# EAGLE design magnet-motor-encoder_v1 (EAGLE 6.6.0)
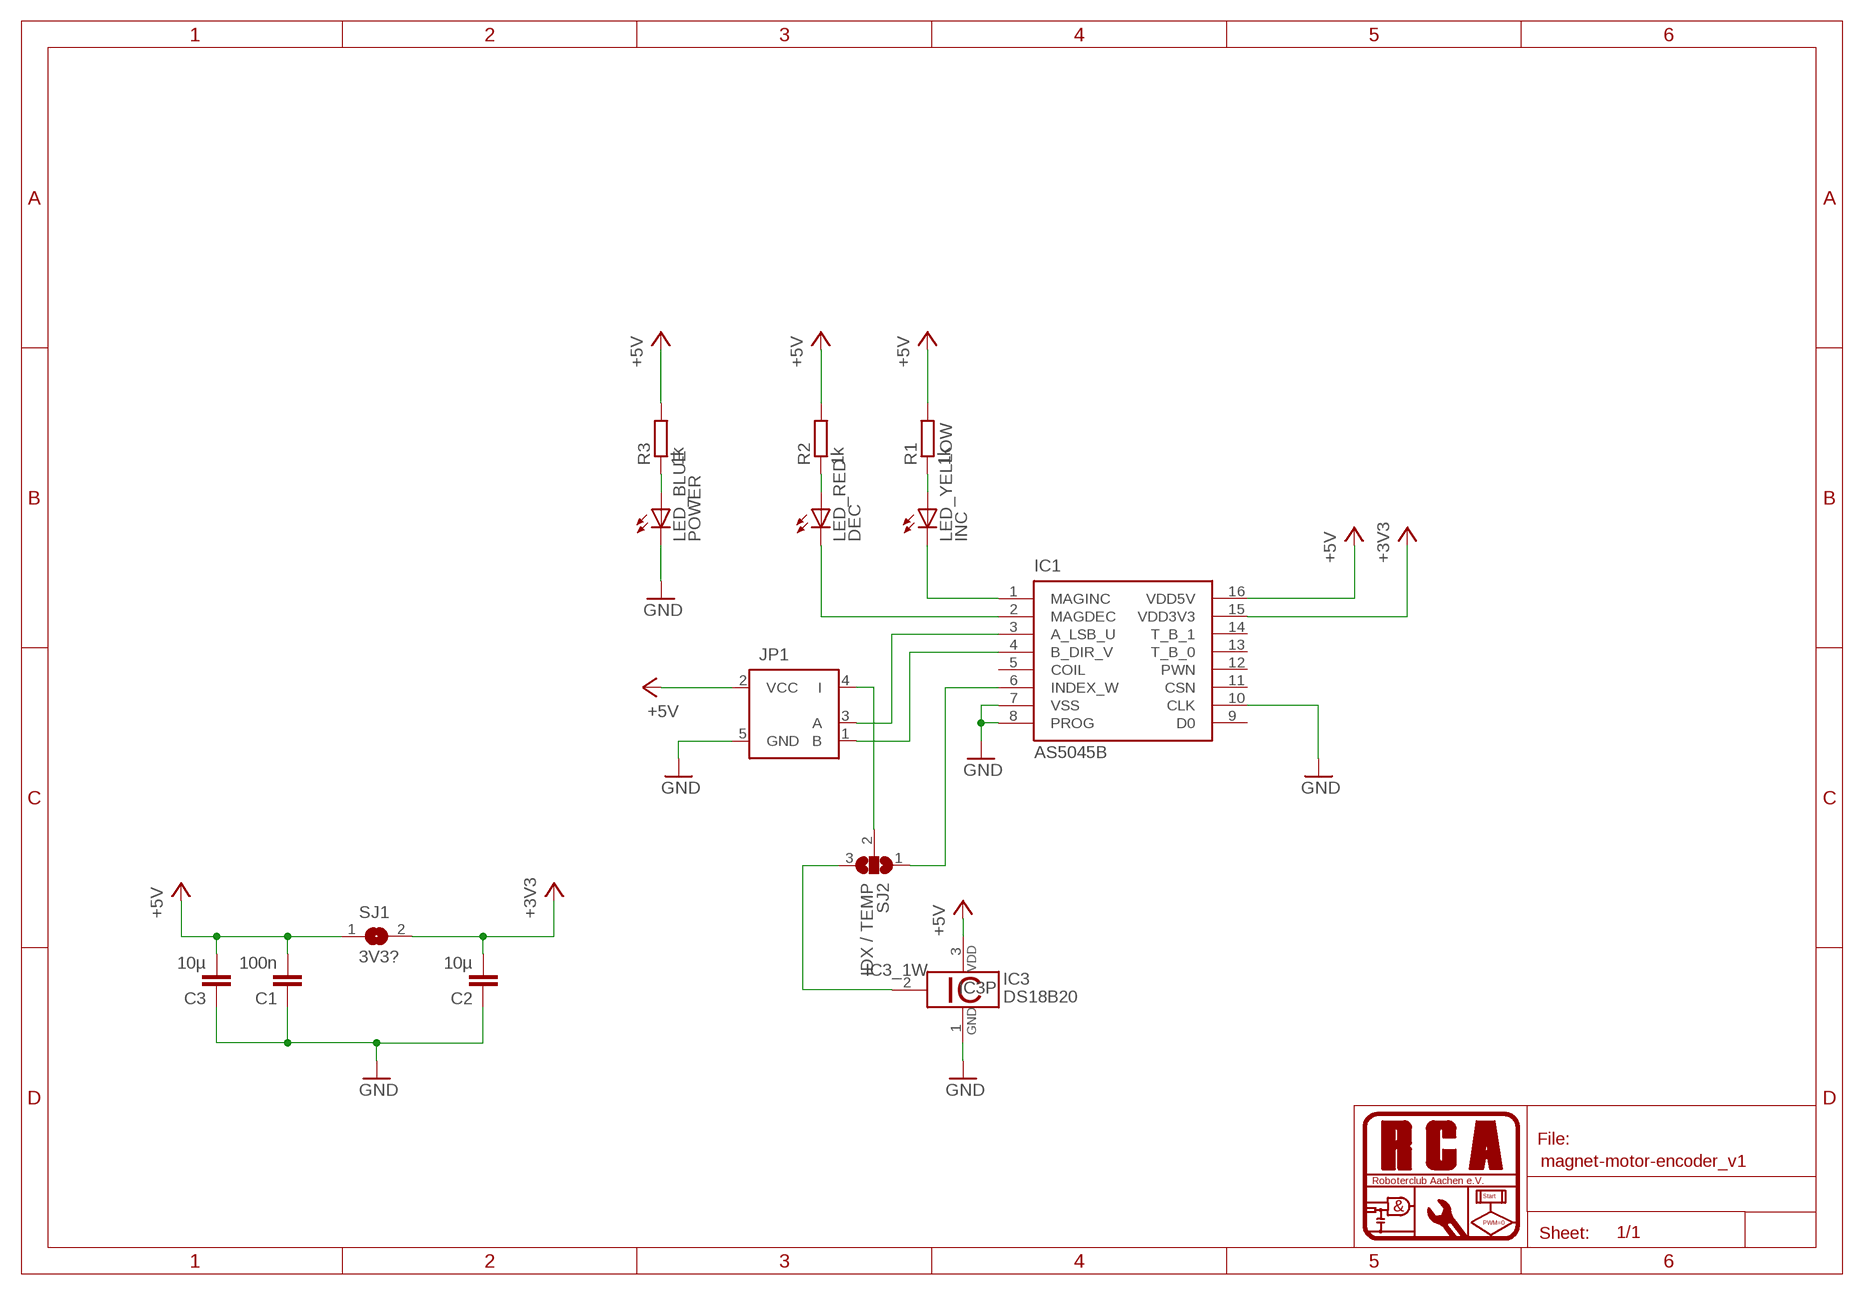
[diagram p0: schematic, sheet 1]

## Parts
C1  100n  C-EUC0805K  [C0805K]
C2  10µ  C-EUC0805K  [C0805K]
C3  10µ  C-EUC0805K  [C0805K]
IC1  AS5045B  AS5040  [SSOP16]
IC3  DS18B20  DS18S20  [TO92-]
JP1  ENCODERPSS  [22-23-2051]
LED_BLUE  POWER  LEDCHIPLED_0805  [CHIPLED_0805]
LED_RED  DEC  LEDCHIPLED_0805  [CHIPLED_0805]
LED_YELLOW  INC  LEDCHIPLED_0805  [CHIPLED_0805]
R1  1k  R-EU_R0805  [R0805]
R2  1k  R-EU_R0805  [R0805]
R3  1k  R-EU_R0805  [R0805]
SJ1  3V3?  SJS  [SJS]
SJ2  IDX / TEMP  SJ2W  [SJ_2]

## Nets
+3V3: C2.2 IC1.15(VDD3V3) SJ1.2
+5V: C1.2 C3.2 IC1.16(VDD5V) IC3.3 JP1.2(VCC) R1.2 R2.2 R3.2 SJ1.1
A: IC1.3(A_LSB_U) JP1.3(A)
B: IC1.4(B_DIR_V) JP1.1(B)
GND: C1.1 C2.1 C3.1 IC1.7(VSS) IC1.8(PROG) IC1.10(CLK) IC3.1 JP1.5(GND) LED_BLUE.C
LED_RED: IC1.2(MAGDEC) LED_RED.C
LED_YELLOW: IC1.1(MAGINC) LED_YELLOW.C
N$1: JP1.4(I) SJ2.2
N$2: IC1.6(INDEX_W) SJ2.1
N$3: IC3.2 SJ2.3
R_LED_BLUE: LED_BLUE.A R3.1
R_LED_RED: LED_RED.A R2.1
R_LED_YELLOW: LED_YELLOW.A R1.1
Unconnected: IC1.5(COIL) IC1.9(D0) IC1.11(CSN) IC1.12(PWN) IC1.13(T_B_0) IC1.14(T_B_1)

## Library data of the parts
C1-C3 = resistor:C-EU: CAPACITOR, European symbol
IC1 = austriamicrosystems:AS5040: 10-BIT PROGRAMMABLE MAGNETIC ROTARY ENCODER Source: www.austriamicrosystems.com .. AS5040DataSheetRev12.pdf; MPN: AS5040ASSU; OC_FARNELL: 1630800; OC_NEWARK: 59P4059
IC3 = 1wire:DS18S20: High Precision Digital Thermometer This chip provides a onewire thermosensor with approx. 0.5°C accuracy.A programmable over/undertemperure alarm is available. Notes: Vdd must be applied for accurate measurements at low temperatures, as the parasite power circuit otherwise heats the sensor. If parasite power is used, Vdd has to be connected to GND. The DS1822 is a low-cost thermometer chip, the DS18B20 is similar to the DS18S20, but with 9..12 Bit programmable precision. Author: Jan Kandziora <jjj@gmx.de>
JP1 = rca_stecker:ENCODER: Encoder Stecker ab 2013: passt direkt auf die Dunkermotoren. vor 2013: Pinout umgedreht
LED_BLUE LED_RED LED_YELLOW = led:LED: LED OSRAM: - CHIPLED LG R971, LG N971, LY N971, LG Q971, LY Q971, LO R971, LY R971 LH N974, LH R974 LS Q976, LO Q976, LY Q976 LO Q996 - Hyper CHIPLED LW Q18S LB Q993, LB Q99A, LB R99A - SideLED LS A670, LO A670, LY A670, LG A670, LP A670 LB A673, LV A673, LT A673, LW A673 LH A674 LY A675 LS A676, LA A676, LO A676, LY A676, LW A676 LS A679, LY A679, LG A679 - Hyper Micro SIDELED® LS Y876, LA Y876, LO Y876, LY Y876 LT Y87S - SmartLED LW L88C, LW L88S LB L89C, LB L89S, LG L890 LS L89K, LO L89K, LY L89K LS L896, LA L896, LO L896, LY L896 - TOPLED LS T670, LO T670, LY T670, LG T670, LP T670 LSG T670, LSP T670, LSY T670, LOP T670, LYG T670 LG T671, LOG T671, LSG T671 LB T673, LV T673, LT T673, LW T673 LH T674 LS T676, LA T676, LO T676, LY T676, LB T676, LH T676, LSB T676, LW T676 LB T67C, LV T67C, LT T67C, LS T67K, LO T67K, LY T67K, LW E67C LS E67B, LA E67B, LO E67B, LY E67B, LB E67C, LV E67C, LT E67C LW T67C LS T679, LY T679, LG T679 LS T770, LO T770, LY T770, LG T770, LP T770 LB T773, LV T773, LT T773, LW T773 LH T774 LS E675, LA E675, LY E675, LS T675 LS T776, LA T776, LO T776, LY T776, LB T776 LHGB T686 LT T68C, LB T68C - Hyper Mini TOPLED® LB M676 - Mini TOPLED Santana® LG M470 LS M47K, LO M47K, LY M47K Source: http://www.osram.convergy.de LUXEON: - LUMILED® LXK2-PW12-R00, LXK2-PW12-S00, LXK2-PW14-U00, LXK2-PW14-V00 LXK2-PM12-R00, LXK2-PM12-S00, LXK2-PM14-U00 LXK2-PE12-Q00, LXK2-PE12-R00, LXK2-PE12-S00, LXK2-PE14-T00, LXK2-PE14-U00 LXK2-PB12-K00, LXK2-PB12-L00, LXK2-PB12-M00, LXK2-PB14-N00, LXK2-PB14-P00, LXK2-PB14-Q00 LXK2-PR12-L00, LXK2-PR12-M00, LXK2-PR14-Q00, LXK2-PR14-R00 LXK2-PD12-Q00, LXK2-PD12-R00, LXK2-PD12-S00 LXK2-PH12-R00, LXK2-PH12-S00 LXK2-PL12-P00, LXK2-PL12-Q00, LXK2-PL12-R00 Source: www.luxeon.com KINGBRIGHT: KA-3528ASYC Source: www.kingbright.com
R1-R3 = resistor:R-EU_: RESISTOR, European symbol
SJ1 = rca_sontiges:SJ: SMD solder JUMPER
SJ2 = jumper:SJ2W: SMD solder JUMPER

## Board
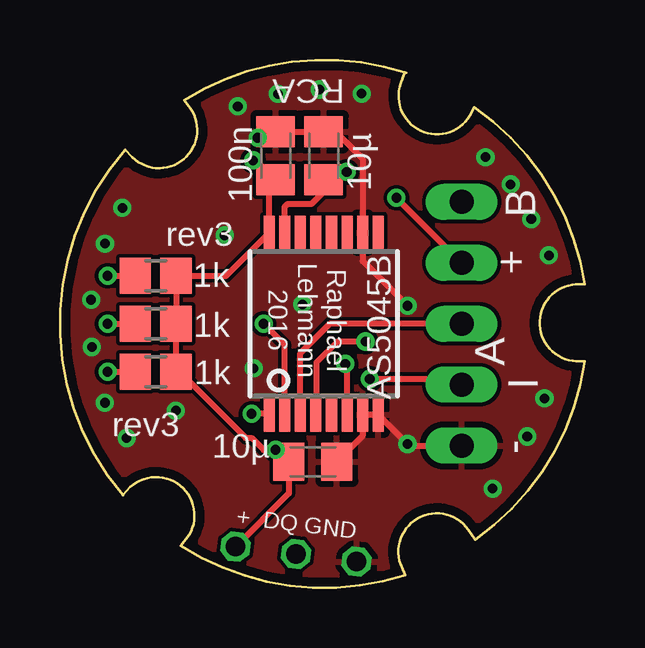
[diagram p1: board, top side]
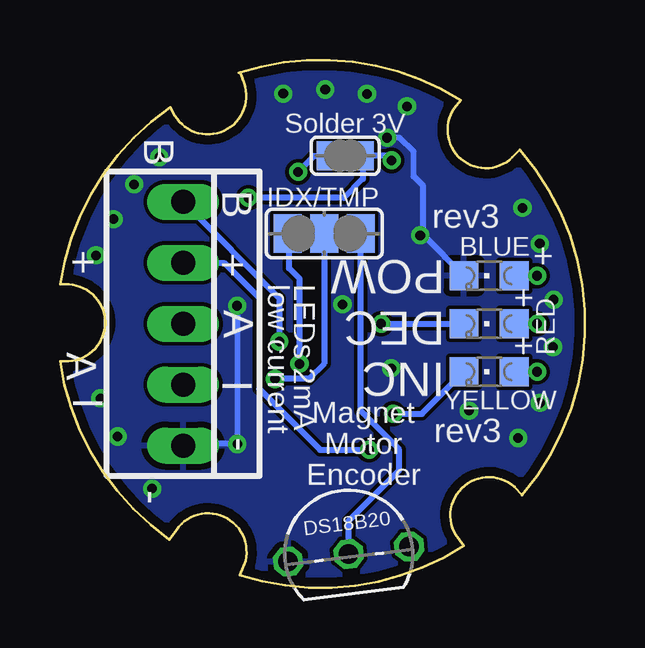
[diagram p2: board, bottom side, seen from below]

Size 21.87 x 21.98 mm. Coordinates in mm from the lower left corner, seen from the top.
Outline: 14.42,21.44 arc50 5.17,20.31 5.44,19.97 arc-169 3.02,17.92 2.72,18.24 arc82 2.63,3.84
Outline: 17.31,2 arc47 21.87,9.42 21.52,9.43 arc-174 21.5,12.63 21.87,12.63 arc47 17.27,20.01 17.08,19.66 arc-168 14.2,21.01
Outline: 2.62,3.85 2.94,4.2
Outline: 2.93,4.19 arc-162 5.39,2.19 5.04,1.74 arc51 14.38,0.52 14.14,1.12 arc-158 17.01,2.41 17.31,1.99
Outline: 14.2,21.02 14.36,21.46
Copper layers (1*16): Top 0.0356mm / dielectric 1.5011mm / Bottom 0.0356mm
Design rules "LaenPCBOrder *": minimum track width 6mil, minimum drill 13mil, track to track 6mil, track to pad 6mil, pad to pad 6mil, via to via 6mil, smd to smd 6mil, copper to edge 15mil, drill to drill 6mil, minimum pad ring 7mil, minimum via ring 7mil, stop-mask expansion 3mil, vias tented up to drill 20mil, thermal gap 10mil

### Footprints (pad centres in the part's own frame; a part is rotated, then mirrored left to right if it is on the bottom)
C0805K = smd 1.3 x 1.6: 1 -1,0; 2 1,0
SSOP16 = smd 0.46 x 1.43: 1 -2.275,-3.795; 2 -1.625,-3.795; 3 -0.975,-3.795; 4 -0.325,-3.795; 5 0.325,-3.795; 6 0.975,-3.795; 7 1.625,-3.795; 8 2.275,-3.795; 9 2.275,3.795; 10 1.625,3.795; 11 0.975,3.795; 12 0.325,3.795; 13 -0.325,3.795; 14 -0.975,3.795; 15 -1.625,3.795; 16 -2.275,3.795
TO92- = drill 0.813 octagon: 1 -2.54,0; 2 0,0; 3 2.54,0
22-23-2051 = drill 1 long: 1 -5.08,0; 2 -2.54,0; 3 0,0; 4 2.54,0; 5 5.08,0
CHIPLED_0805 = smd 1.2 x 1.2: A 0,-1.05; C 0,1.05
R0805 = smd 1.3 x 1.5: 1 -0.85,0; 2 0.85,0
SJS = smd 1 x 1.2: 1 -0.683,0; 2 0.683,0
SJ_2 = smd 1.168 x 1.6: 1 -1.524,0; 2 0,0; 3 1.524,0

### Placement (x,y rotation side)
C1  8.99,17.99 270 top
C2  10.99,17.99 270 top
C3  10.54,5.24 180 top
IC1  10.99,10.99 0 top
IC3  9.84,1.39 7 bottom
JP1  16.74,10.99 270 bottom
LED_BLUE  3.99,12.99 90 bottom
LED_RED  3.99,10.99 90 bottom
LED_YELLOW  3.99,8.99 90 bottom
R1  3.99,8.99 0 top
R2  3.99,10.99 0 top
R3  3.99,12.99 0 top
SJ1  9.99,17.99 180 bottom
SJ2  10.86,14.75 0 bottom

### Tracks (layer width: path | path; a pad name or v marks a point on that pad's centre or on a via)
+3V3  (via drill 0.4)
  Top 0.254: IC1.15 9.36,15.87 9.49,15.99 10.49,15.99 10.99,16.49 | 10.99,16.49 C2.2 | 10.99,16.49 11.24,16.74 11.37,16.74 v11.95,17.32
  Bottom 0.254: 10.67,17.81 SJ1.2 11.28,17.99 v11.95,17.32
+5V  (via drill 0.4)
  Top 0.254: 8.99,16.96 C1.2 8.71,16.72 IC1.16 6.92,12.99 R3.2 R2.2 R1.2 4.99,8.99 7.74,6.24 7.99,6.24 8.49,5.74 v8.99,5.74 9.04,5.74 C3.2 9.54,3.92 IC3.3 | 8.99,16.96 8.99,16.74 8.74,16.49 | 8.99,16.96 8.15,17.8 v8.05,17.8 | JP1.2 v14.02,16.24
  Bottom 0.254: v8.99,5.74 11.03,5.74 13.57,8.28 13.57,12.07 15.03,13.53 JP1.2 | v14.02,16.24 10.03,16.24 9.24,17.03 9.24,17.93 SJ1.1 8.24,17.99 v8.05,17.8
A
  Top 0.254: IC1.3 10.01,9.77 11.24,10.99 JP1.3
B  (via drill 0.4)
  Top 0.254: v12.73,10.25 11.56,10.25 10.69,9.38 10.69,7.22 IC1.4
  Bottom 0.254: JP1.1 12.73,12.06 v12.73,10.25
GND  (via drill 0.4)
  Top 0.254: v8.24,18.74 8.49,18.99 C1.1 C2.1 11.49,18.99 12.61,17.87 IC1.10 12.61,13.62 v14.49,11.74 | v14.48,5.98 IC1.8 IC1.7 12.61,6.32 C3.1 | v14.48,5.98 14.55,5.91 | 14.55,5.91 14.48,5.84 | v14.48,5.98 14.48,5.84 | 14.48,5.84 14.43,5.8 | 14.55,5.91 JP1.5
  Bottom 0.254: LED_BLUE.C 6.74,14.69 6.74,16.73 7.14,17.13 7.14,18.17 7.71,18.74 v8.24,18.74 | v14.49,11.74 v14.49,5.99 | v14.49,5.99 v14.48,5.98 | v14.49,5.99 16.66,5.99 JP1.5
  other vias: 12.57,20.58 7.41,20.05 20.19,7.88 18.78,16.8 19.47,6.29 4.83,7.37 8.07,9.13 6.86,14.67 2.6,15.82 9.08,20.57 10.82,20.75 17.73,17.93 19.64,15.35 20.37,13.84 18.03,4.12 1.88,14.33 1.3,11.99 1.33,10.02 1.87,7.7 2.78,6.23 10.1,11.8
  pour Bottom: -1.01,22.99 22.99,22.99 22.99,-1.01 -1.01,-1.01
  pour Top: -1.01,22.99 22.99,22.99 22.99,-1.01 -1.01,-1.01
LED_RED  (via drill 0.4)
  Top 0.254: IC1.2 9.36,10.12 v8.49,10.99
  Bottom 0.254: v8.49,10.99 LED_RED.C
LED_YELLOW  (via drill 0.4)
  Top 0.254: IC1.1 8.71,7.22 8.74,7.24 v7.99,7.24
  Bottom 0.254: v7.99,7.24 6.79,7.24 LED_YELLOW.C
N$1  (via drill 0.4)
  Top 0.254: v12.91,8.69 16.5,8.69 JP1.4
  Bottom 0.254: SJ2.2 10.86,9.33 11.5,8.69 v12.91,8.69
N$2  (via drill 0.4)
  Top 0.254: IC1.6 11.96,9.25 v11.89,9.32
  Bottom 0.254: v11.89,9.32 11.89,12.87 12.32,13.3 12.32,14.69 SJ2.1
N$3
  Bottom 0.254: SJ2.3 9.33,7.36 7.74,5.76 7.74,4.88 9.84,2.78 IC3.2
R_LED_BLUE  (via drill 0.4)
  Top 0.254: v1.99,12.99 R3.1
  Bottom 0.254: v1.99,12.99 LED_BLUE.A R3.1
R_LED_RED  (via drill 0.4)
  Top 0.254: v1.99,10.99 R2.1
  Bottom 0.254: LED_RED.A v1.99,10.99
R_LED_YELLOW  (via drill 0.4)
  Top 0.254: v1.99,8.99 R1.1
  Bottom 0.254: LED_YELLOW.A v1.99,8.99

### Text on the board
tNames: RCA | B | rev3 | + | Raphael / Lehmann / 2016 | A | I | rev3 | - | + DQ GND
bNames: Solder 3V | B | B | IDX/TMP | rev3 | BLUE | INC / DEC / POW | + | LEDs 2mA | low current | + | + | RED | + | A | + | A | I | YELLOW | I | rev3 | Magnet / Motor / Encoder | - | -